# Altium project UCLA-DRS4.PrjPCB (part 4 of 10)

## Sheet DAC.SchDoc: My title
size A3; Organization: University of California; Address1: 475 Portola Plaza; Address2: Los Angeles, CA 90095; DocumentNumber: 28; Revision: R01; SheetNumber: 28; SheetTotal: 35
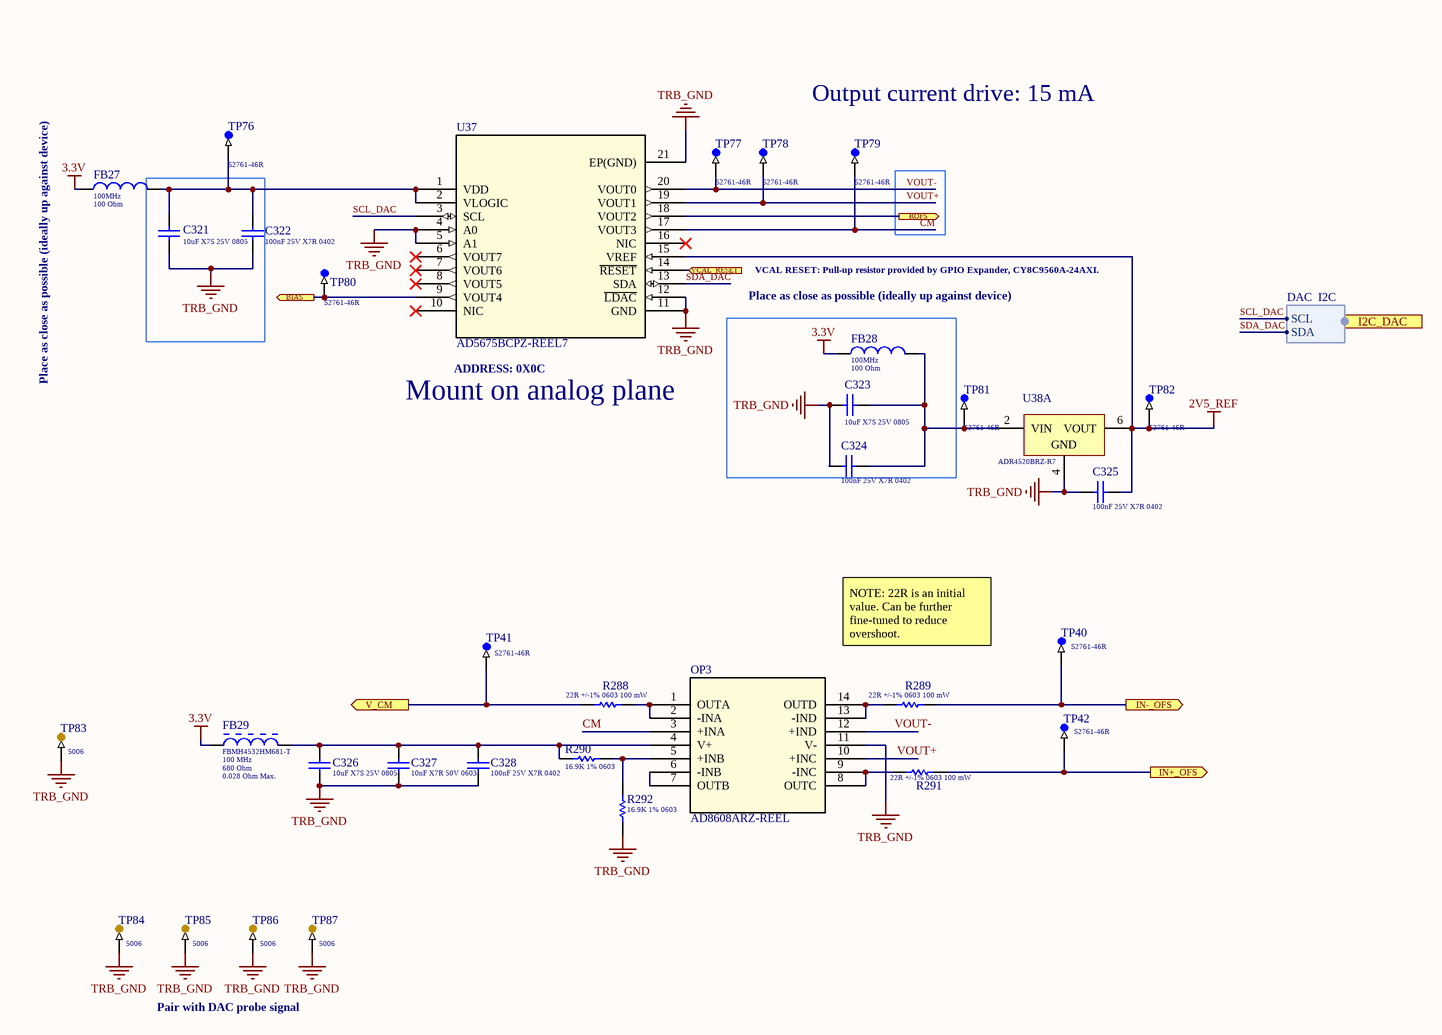
[diagram p8: DAC.SchDoc]

### Parts
C321  Capacitance: 10uF X7S 25V 0805  [Cap_Murata_ GRM21BC71E106ME11L_10uF]  (hidden comment: Cap_Murata_ GRM21BC71E106ME11L_10uF)
C322  Capacitance: 100nF 25V X7R 0402  [Cap_Taiyo_Yuden_TMK105B7104KV-FR_100nF]  (hidden comment: Cap_Taiyo_Yuden_TMK105B7104KV-FR_100nF)
C323  Capacitance: 10uF X7S 25V 0805  [Cap_Murata_ GRM21BC71E106ME11L_10uF]  (hidden comment: Cap_Murata_ GRM21BC71E106ME11L_10uF)
C324  Capacitance: 100nF 25V X7R 0402  [Cap_Taiyo_Yuden_TMK105B7104KV-FR_100nF]  (hidden comment: Cap_Taiyo_Yuden_TMK105B7104KV-FR_100nF)
C325  Capacitance: 100nF 25V X7R 0402  [Cap_Taiyo_Yuden_TMK105B7104KV-FR_100nF]  (hidden comment: Cap_Taiyo_Yuden_TMK105B7104KV-FR_100nF)
C326  Capacitance: 10uF X7S 25V 0805  [Cap_Murata_ GRM21BC71E106ME11L_10uF]  (hidden comment: Cap_Murata_ GRM21BC71E106ME11L_10uF)
C327  Capacitance: 10nF X7R 50V 0603  [Kemet_C0603_0]  (hidden comment: Cap_Kemet_C0603C103J5RACTU_eec)
C328  Capacitance: 100nF 25V X7R 0402  [Cap_Taiyo_Yuden_TMK105B7104KV-FR_100nF]  (hidden comment: Cap_Taiyo_Yuden_TMK105B7104KV-FR_100nF)
FB27  Measuring Frequency: 100MHz  Impedance: 100 Ohm  [FB_Wurth_Electronics_742792731_100Ohms]  (hidden comment: 742792731)
FB28  Measuring Frequency: 100MHz  Impedance: 100 Ohm  [FB_Wurth_Electronics_742792731_100Ohms]  (hidden comment: 742792731)
FB29  Measuring Frequency: 100 MHz  Nominal Impedance: 680 Ohm  DC Resistance: 0.028 Ohm Max.  [TAYO-FBMH4532-2_V]  (hidden comment: FBMH4532HM681-T)
OP3  AD8608ARZ-REEL  [R_14_ADI-M]
R288  22R +/-1% 0603 100 mW  [RESC1609X50X30ML08T20]
R289  22R +/-1% 0603 100 mW  [RESC1609X50X30ML08T20]
R290  Resistance: 16.9K 1% 0603  [Res_Panasonic_ERJ-3EKF1692V_16.9kOhm]  (hidden comment: Res_Panasonic_ERJ-3EKF1692V_16.9kOhm)
R291  22R +/-1% 0603 100 mW  [RESC1609X50X30ML08T20]
R292  Resistance: 16.9K 1% 0603  [Res_Panasonic_ERJ-3EKF1692V_16.9kOhm]  (hidden comment: Res_Panasonic_ERJ-3EKF1692V_16.9kOhm)
TP40  Series: S2761-46R  [TP_Harwin_S2761_46R]  (hidden comment: TP_Harwin_S2761_46R)
TP41  Series: S2761-46R  [TP_Harwin_S2761_46R]  (hidden comment: TP_Harwin_S2761_46R)
TP42  Series: S2761-46R  [TP_Harwin_S2761_46R]  (hidden comment: TP_Harwin_S2761_46R)
TP76  Series: S2761-46R  [TP_Harwin_S2761_46R]  (hidden comment: TP_Harwin_S2761_46R)
TP77  Series: S2761-46R  [TP_Harwin_S2761_46R]  (hidden comment: TP_Harwin_S2761_46R)
TP78  Series: S2761-46R  [TP_Harwin_S2761_46R]  (hidden comment: TP_Harwin_S2761_46R)
TP79  Series: S2761-46R  [TP_Harwin_S2761_46R]  (hidden comment: TP_Harwin_S2761_46R)
TP80  Series: S2761-46R  [TP_Harwin_S2761_46R]  (hidden comment: TP_Harwin_S2761_46R)
TP81  Series: S2761-46R  [TP_Harwin_S2761_46R]  (hidden comment: TP_Harwin_S2761_46R)
TP82  Series: S2761-46R  [TP_Harwin_S2761_46R]  (hidden comment: TP_Harwin_S2761_46R)
TP83  Series: 5006  [TP_Keystone_Electronics_5006]  (hidden comment: TP_Keystone_Electronics_5006)
TP84  Series: 5006  [TP_Keystone_Electronics_5006]  (hidden comment: TP_Keystone_Electronics_5006)
TP85  Series: 5006  [TP_Keystone_Electronics_5006]  (hidden comment: TP_Keystone_Electronics_5006)
TP86  Series: 5006  [TP_Keystone_Electronics_5006]  (hidden comment: TP_Keystone_Electronics_5006)
TP87  Series: 5006  [TP_Keystone_Electronics_5006]  (hidden comment: TP_Keystone_Electronics_5006)
U37  AD5675  [CP_20_8]  (value not drawn)
U38  ADR4520BRZ-R7  [ADI-R-8_M]  (part A of 2)

### Blocks framed on the sheet
Place as close as possible (ideally up against device): C323 C324 FB28

### Ports
BIAS (out), I2C_DAC (harness DAC  I2C), IN+_OFS (out), IN-_OFS (out), ROFS (out), V_CM (out), VCAL_RESET (in)

### Harnesses
DAC  I2C: SCL, SDA

### Nets
2V5_REF: C325.2 TP82.1 U37.15(VREF) U38.6(VOUT)
3.3V: FB27.1 FB28.1 FB29.1
TRB_GND: C321.2 C322.1 C323.2 C324.1 C325.1 C326.2 C327.2 C328.1 OP3.11(V-) R292.2 TP83.1 TP84.1 TP85.1 TP86.1 TP87.1 U37.4(A0) U37.5(A1) U37.11(GND) U37.12(~{LDAC}) U37.21(EP(GND)) U38.4(GND)
BIAS: TP80.1 U37.9(VOUT4) ; port BIAS
CM: OP3.3(+INA) TP79.1 U37.17(VOUT3)
~{IN}~{_OFS}: R289.2 TP40.1 ; port IN-_OFS
IN+_OFS: R291.2 TP42.1 ; port IN+_OFS
R-OFS: U37.18(VOUT2) ; port ROFS
SCL_DAC: U37.3(SCL) ; port I2C_DAC.SCL
SDA_DAC: U37.13(SDA) ; port I2C_DAC.SDA
V_CM: R288.1 TP41.1 ; port V_CM
VCAL_RESET: U37.14(~{RESET}) ; port VCAL_RESET
VOUT+: OP3.10(+INC) TP78.1 U37.19(VOUT1)
VOUT-: OP3.12(+IND) TP77.1 U37.20(VOUT0)
NetC321_1: C321.1 C322.2 FB27.2 TP76.1 U37.1(VDD) U37.2(VLOGIC)
NetC323_1: C323.1 C324.2 FB28.2 TP81.1 U38.2(VIN)
NetC326_1: C326.1 C327.1 C328.2 FB29.2 OP3.4(V+) R290.2
NetOP3_1: OP3.1(OUTA) OP3.2(-INA) R288.2
NetOP3_5: OP3.5(+INB) R290.1 R292.1
NetOP3_6: OP3.6(-INB) OP3.7(OUTB)
NetOP3_8: OP3.8(OUTC) OP3.9(-INC) R291.1
NetOP3_13: OP3.13(-IND) OP3.14(OUTD) R289.1

Not connected (* = marked no-connect by the designer): U37 6(VOUT7)* 7(VOUT6)* 8(VOUT5)* 10(NIC)* 16(NIC)*

### Notes on the sheet
- Output current drive: 15 mA
- VCAL RESET: Pull-up resistor provided by GPIO Expander, CY8C9560A-24AXI.
- (near FB27) Place as close as possible (ideally up against device)
- Mount on analog plane
- (near U37) ADDRESS: 0X0C
- NOTE: 22R is an initial value. Can be further fine-tuned to reduce overshoot.
- Pair with DAC probe signal
- 475 Portola Plaza
- GAPS TOF
- igarcia91@g.ucla.edu
- Los Angeles, CA
- 310-825-0344
- Size:
- Date:
- Letter
- Revision:
- Time:
- Sheet
- of
- andrew.peck@cern.ch
- spq@ucla.edu
- File:

### Library data of the parts
C321 C323 C326 = Cap_Murata_ GRM21BC71E106ME11L_10uF: CAP CER 10uF 25V X7R 0805; Supplier 1: Mouser; Supplier Part Number 1: 81-GRM21BC71E106ME1L
C322 C324 C325 C328 = Cap_Taiyo_Yuden_TMK105B7104KV-FR_100nF: CAP CER 100nF 25V X7R 0402; Supplier 1: Mouser; Supplier Part Number 1: 963-TMK105B7104KV-FR
C327 = Cap_Kemet_C0603C103J5RACTU_eec: CAP CER 10nF 50V X7R 0603; Manufacturer: Kemet; Mfg Package Ident: C0603; Part Number: C0603C103J5RACTU; helpURL: https://upverter.com/upn/revision/8a8d0c297e33ac74/; ComponentLink2Description: Datasheet; Temperature: -55°C to +125°C; Package: C0603; Supplier 2: Mouser; Price: 0.0184203126773; Supplier 1: Digi-Key; ComponentLink1URL: https://upverter.com/upn/revision/8a8d0c297e33ac74/; Supplier Part Number 2: 80-C0603C103J5R; Supplier Part Number 1: 399-1092-1-ND; Value: 10nF; ComponentLink1Description: Upverter; ComponentLink2URL: https://content.kemet.com/datasheets/KEM_C1002_X7R_SMD.pdf; RoHS: TRUE; Mouser Part Number: 80-C0603C103J5R; Temperature Range High: +125°C; Digikey Description: CAP CER 10000PF 50V X7R 0603; Digikey Part Number: 399-1092-1-ND; Lead Free: yes; Temperature Range Low: -55°C; Voltage: 50V
FB27 FB28 = FB_Wurth_Electronics_742792731_100Ohms: as FB8 on sheet DRS4_ADC; Supplier 1: Mouser; Supplier Part Number 1: 710-742792731
FB29 = FBMH4532HM681-T: Chip Bead Inductor for Power Lines, 680 Ohm, 4 A, -40 to 125 degC, 2-Pin 4.5 x 3.2 x 3.5 mm SMD, RoHS, Taping; Manufacturer: Taiyo Yuden; Rated Current: 4 A Max.; Impedance Tolerance: +/- 25%; ComponentLink1Description: Manufacturer URL; ComponentLink2Description: Datasheet; DatasheetVersion: 09/2014; ComponentLink3URL: http://www.yuden.co.jp/productdata/catalog/en/chipbeads01_e.pdf; ComponentLink3Description: Package Specification; ComponentLink1URL: http://www.t-yuden.com/; Mounting Technology: Surface Mount; Packing: Taping; Temperature Range: -40 to 125 degC; PartNumber: FBMH4532HM681-T; PackageDescription: 2-Pin Surface Mount Device, Body 4.5 x 3.2 mm, Height 3.5 mm; ComponentLink2URL: http://www.yuden.co.jp/productdata/catalog/en/chipbeads01_e.pdf; RoHS: TRUE; Supplier 1: Digi-Key; Supplier Part Number 1: 587-1761-6-ND
OP3 = AD8608ARZ-REEL: IC OPAMP GP 4 CIRCUIT 14SOIC; Built_By: EMA_UL_Team; Vendor: Analog Devices Inc; SourceLibrary: Analog_2012-01-01_6; Manufacturer_Part_Number: AD8608ARZ-REEL; Copyright: Copyright (C) 2018 Accelerated Designs. All rights reserved; RefDes: RefDes; Type: DEV
R288 R289 R291 = CMP-009-00027-1: Chip Resistor, 22 Ohm, +/- 1%, 100 mW, -55 to 155 degC, 0603 (1608 Metric); Resistance: 22; Power: 100mW; Voltage Rating: 75V; Min Operating Temperature: -55°C; RoHS Compliant: True; Max Operating Temperature: 155°C; Tolerance: 1%; Case/Package: 0603; Mounting Technology: SM
R290 R292 = Res_Panasonic_ERJ-3EKF1692V_16.9kOhm: RES SMD 16.9k OHM 5% 1/10W 0603; Supplier 1: Mouser; Supplier Part Number 1: 667-ERJ-3EKF1692V
TP40-TP42 TP76-TP82 = TP_Harwin_S2761_46R: Circuit Board Hardware - PCB SMT Mini Test Terminal, Reel; Supplier 1: Newark; Supplier Part Number 1: 76Y5391
TP83-TP87 = TP_Keystone_Electronics_5006: Circuit Board Hardware - PCB TEST POINT BLK .063; Supplier 1: Mouser; Supplier Part Number 1: 534-5006
U37 = AD5675BCPZ-REEL7: Digital to Analog Converters - DAC 16-bit octal I2C nanoDAC; Vendor: Analog Devices Inc; Built_By: Analog Devices Inc.; Manufacturer_Part_Number: AD5675BCPZ-REEL7; RefDes: RefDes; Type: DEV; Value: Value; Supplier Part Number 1: 584-AD5675BCPZ-REEL7; Supplier 1: Mouser; Series: AD5675BCPZ-REEL7
U38 = CMP-0784-00295-1: Ultralow Noise, High Accuracy Voltage Reference, 2.048 V Output, 3 to 15 V Supply, Industrial, 8-pin SOIC (R-8), Reel; Manufacturer: Analog Devices; Min V Supply (V): 3; Vout: 2.048V; Max V Supply (V): 15; Ref Out TC (ppm/C): 2; ComponentLink3Description: Package Specification; Packing: Reel; ComponentLink1URL: http://www.analog.com/en/index.html; ComponentLink3URL: http://www.analog.com/static/imported-files/packages/PKG_PDF/SOIC_Narrow%20(R)/R_8.pdf; ComponentLink2URL: http://www.analog.com/static/imported-files/data_sheets/ADR4520_4525_4530_4533_4540_4550.pdf; ComponentLink2Description: Datasheet; PartNumber: ADR4520BRZ-R7; ComponentLink1Description: Manufacturer URL; PackageVersion: 060506-A, 06/2006; Operating Temp Range: -40 to 125 degC; ComponentLink4URL: Product URL:http://www.analog.com/en/special-linear-functions/voltage-references/adr4520/products/product.html; PackageReference: R-8; Code_JEDEC: MS-012-AA; Mounting Technology: Surface Mount; DatasheetVersion: Rev. 0; ComponentLink4Description: URL Link1; PackageDescription: 8-Pin Standard Small Outline Package, Body 4.9 x 3.9 mm, Pitch 1.27 mm